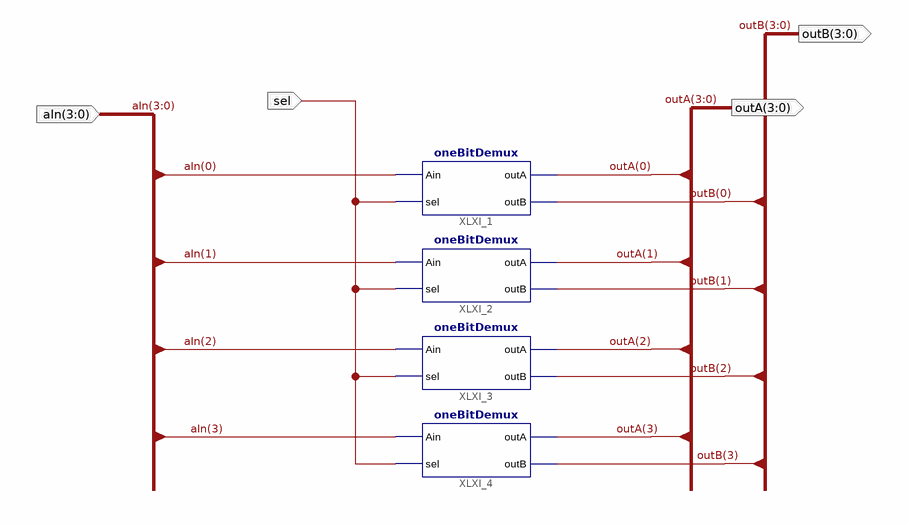
[diagram p0: schematic sheet 1]
// Xilinx ISE schematic fourBitDemux.sch (spartan3e) as structural Verilog: 4 symbols, 4 ports
module fourBitDemux (
  input  [3:0] aIn,
  input  sel,
  output [3:0] outA,
  output [3:0] outB
);

  oneBitDemux XLXI_1 (.Ain(aIn[0]), .sel(sel), .outA(outA[0]), .outB(outB[0]));
  oneBitDemux XLXI_2 (.Ain(aIn[1]), .sel(sel), .outA(outA[1]), .outB(outB[1]));
  oneBitDemux XLXI_3 (.Ain(aIn[2]), .sel(sel), .outA(outA[2]), .outB(outB[2]));
  oneBitDemux XLXI_4 (.Ain(aIn[3]), .sel(sel), .outA(outA[3]), .outB(outB[3]));
endmodule
